# EasyEDA Pro project 25工创PCB.eprj, schematic 云台底部分线板原理图
Board Name: 分线板; Create Date: 2024-12-19; Page Name: P1; Project Name: 25工创PCB; Schematic Name: Schematic2; Update Date: 2024-12-21; Company: 嘉立创EDA; Page Size: A4; Version: V1.0
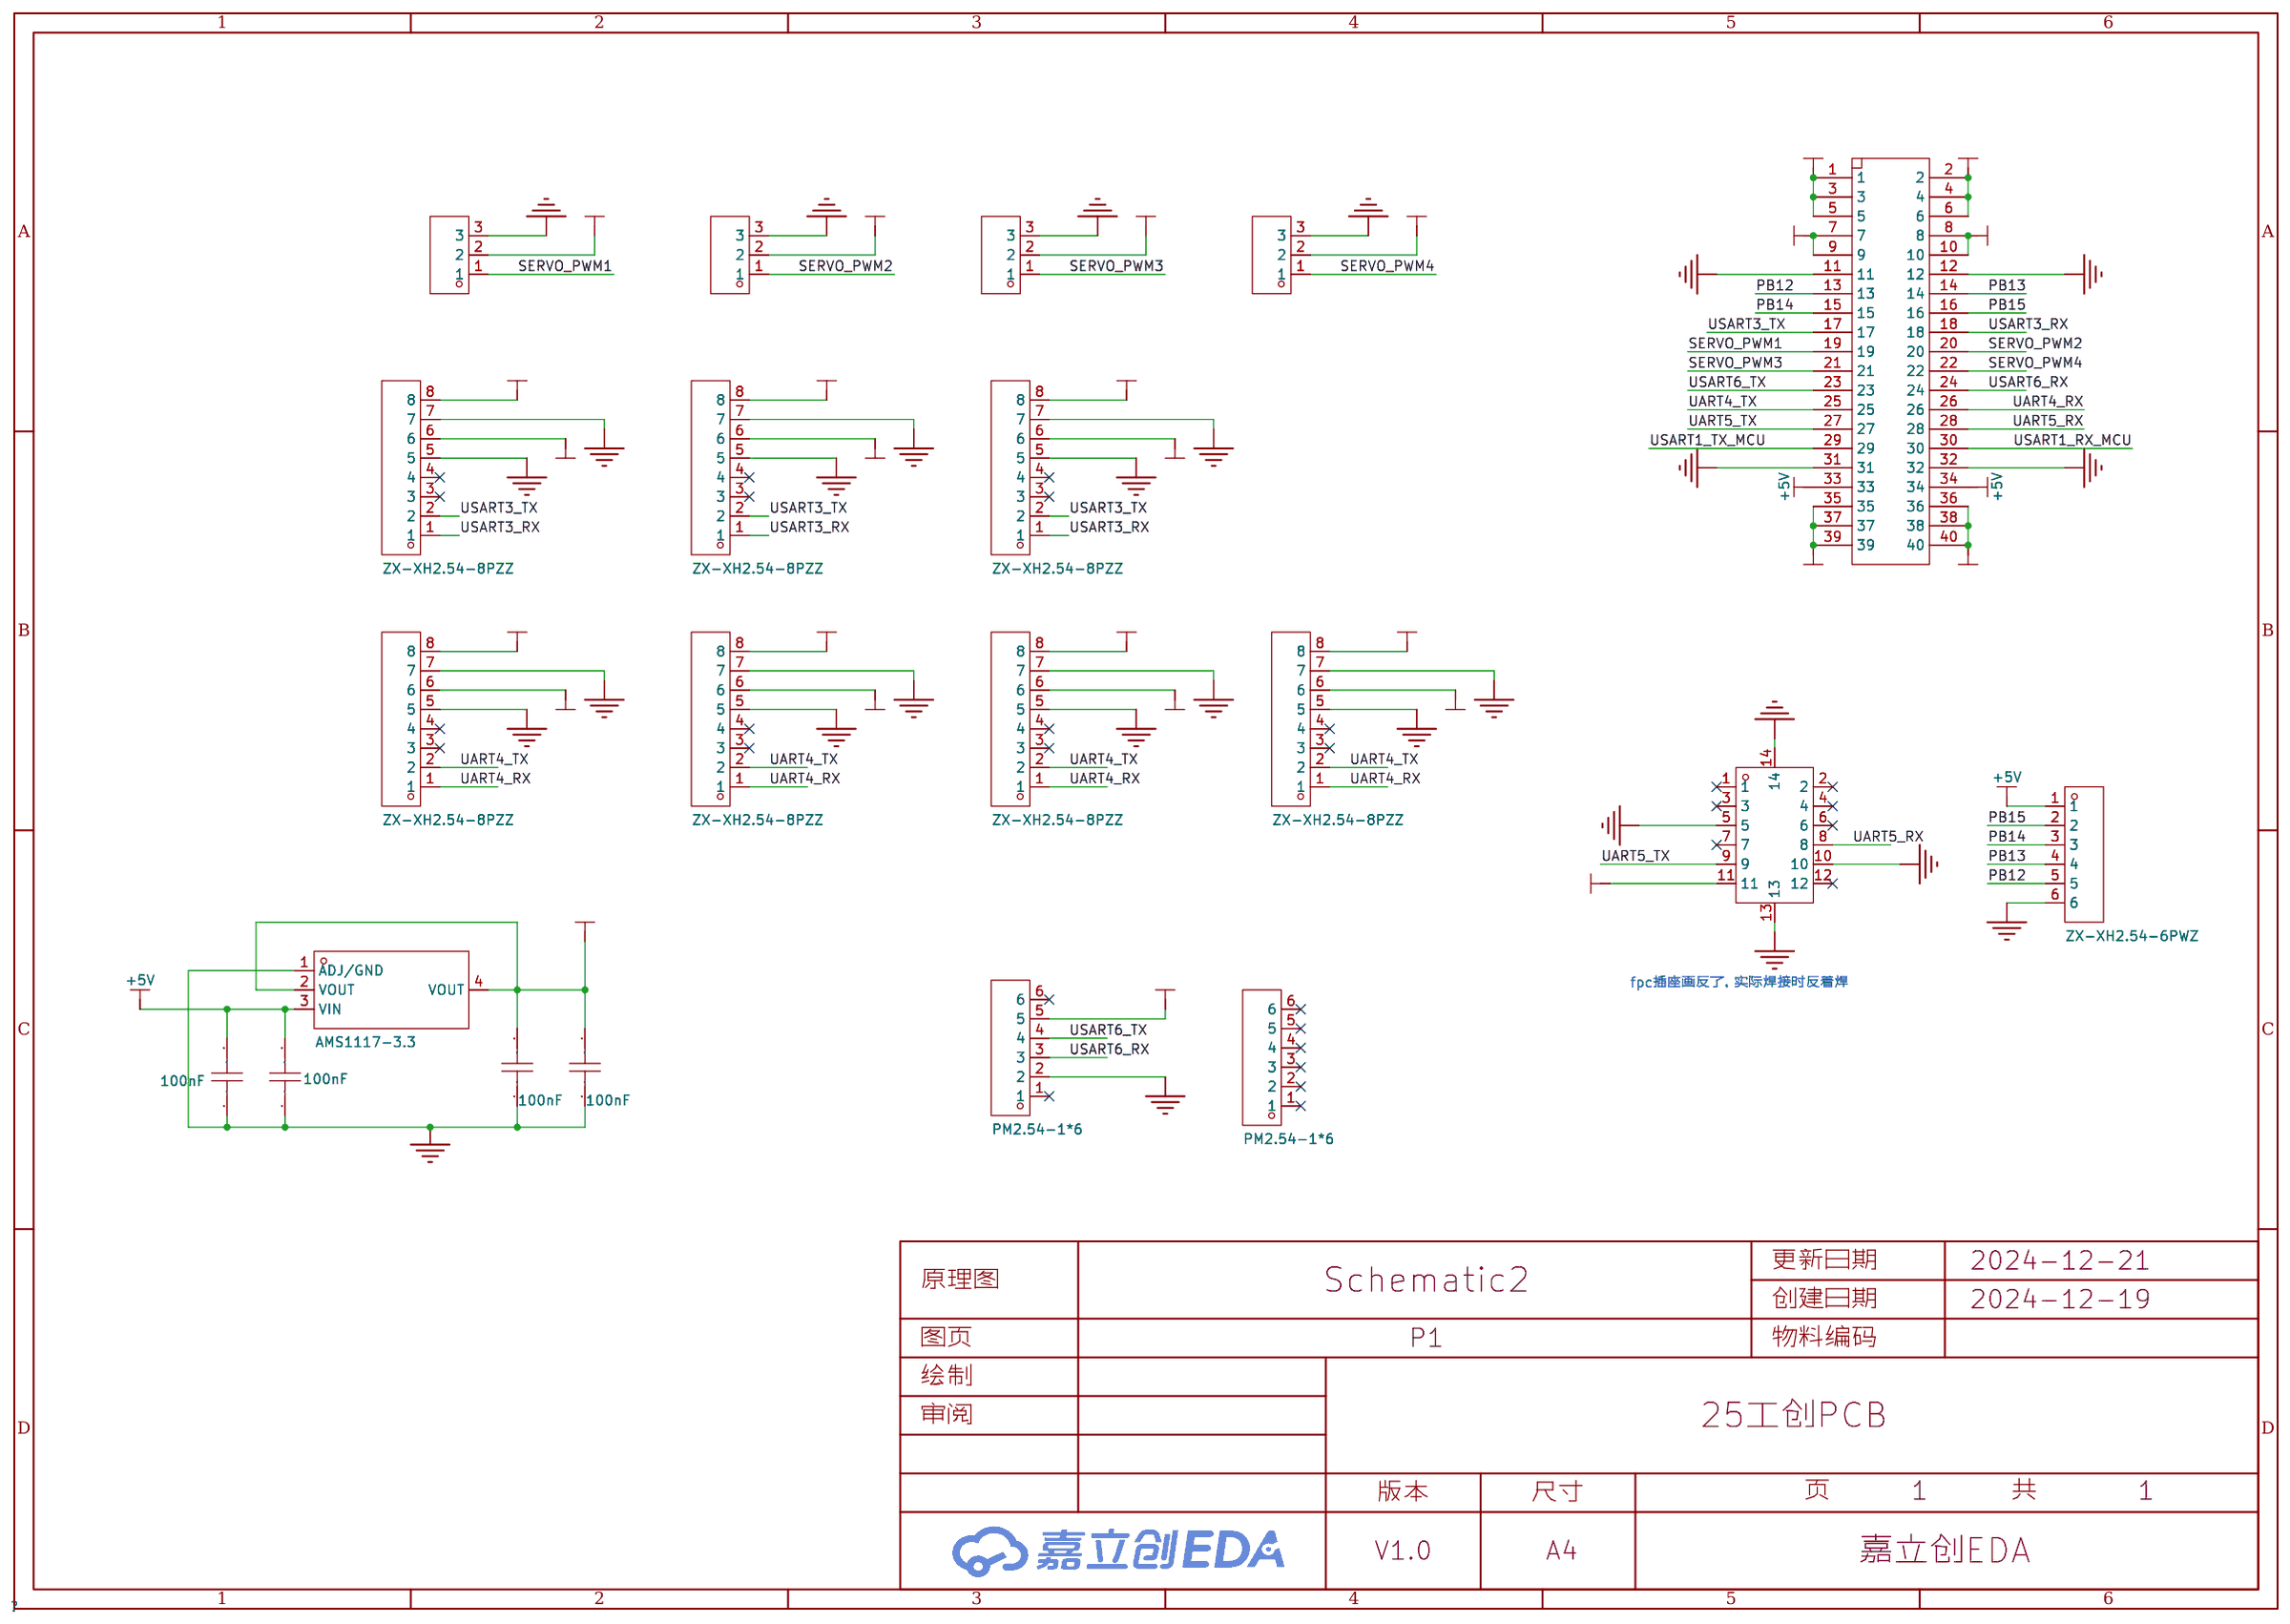
[diagram p2: schematic sheet]

## Parts
C1  100nF  [C0603]
C2  100nF  [C0603]
C3  100nF  [C0603]
C4  100nF  [C0603]
CN1  B-3000R40P-0110  [IDC-TH_40P-P2.54_300R-40P]
CN2  ZX-XH2.54-8PZZ  [CONN-TH_8P-P2.50-XH2.54-8P]
CN3  ZX-XH2.54-8PZZ  [CONN-TH_8P-P2.50-XH2.54-8P]
CN4  ZX-XH2.54-8PZZ  [CONN-TH_8P-P2.50-XH2.54-8P]
CN5  ZX-XH2.54-8PZZ  [CONN-TH_8P-P2.50-XH2.54-8P]
CN6  ZX-XH2.54-8PZZ  [CONN-TH_8P-P2.50-XH2.54-8P]
CN7  ZX-XH2.54-8PZZ  [CONN-TH_8P-P2.50-XH2.54-8P]
CN8  ZX-XH2.54-8PZZ  [CONN-TH_8P-P2.50-XH2.54-8P]
H1  -  [HDR-TH_3P-P2.54-V-M]
H2  -  [HDR-TH_3P-P2.54-V-M]
H3  -  [HDR-TH_3P-P2.54-V-M]
H4  -  [HDR-TH_3P-P2.54-V-M]
HWT1  PM2.54-1*6  [hdr-th_6p-p2.54-v-f]
U1  FPC-0.5AL-12PB  [FPC-SMD_12P-P0.50_XUNPU_FPC-0.5AL-12PB]
U2  ZX-XH2.54-6PWZ  [CONN-TH_6P-P2.50_ZX-XH2.54-6PWZ]
U3  AMS1117-3.3  [SOT-223_L6.5-W3.5-P2.30-LS7.0-BR]
U4  PM2.54-1*6  [hdr-th_6p-p2.54-v-f]

## Library data of the parts
C1-C4 = CAP_0603: Supplier Footprint: 0603
CN1 = B-3000R40P-0110: LCSC Part Name: 2.54mm 2x20P 排数:2 每排P数:20; Supplier Part: C146628; Manufacturer: Ckmtw(灿科盟); Supplier Footprint: 弯插,P=2.54mm; JLCPCB Part Class: 扩展库; Datasheet: https://atta.szlcsc.com/upload/public/pdf/source/20180105/C132444_15151572301921234454.pdf; Supplier: LCSC; Connector Type: 简牛座; Pitch: 2.54mm; Structure: 2x20P; Holder Type: 弯插; Row Spacing: 2.54mm; Number of Rows: 2; Pin Number in each Row: 20; Contact Material: 黄铜; Contact Plating: 金
CN2-CN8 = ZX-XH2.54-8PZZ: Supplier Part: C7429638; Manufacturer: Megastar(兆星); Supplier Footprint: 插件,P=2.54mm; JLCPCB Part Class: 扩展库; Datasheet: https://atta.szlcsc.com/upload/public/pdf/source/20230619/688603DEA58996C00B1F33C46797D2C3.pdf; Supplier: LCSC; Pins Structure: 1x8P; Pitch: 2.54mm; Mounting Style: 直插; Reference Series: XH; Number of Pins: 8P; Number of Rows: 1; Number of PINs Per Row: 8; Current Rating (Max): 3A; Contact Material: 黄铜; Contact Plating: 锡; Operating Temperature Range: -25℃~+85℃
H1-H4 = HDR-M_2.54_1x3P: Supplier Part: C2937625; Supplier Footprint: 插件
HWT1 U4 = PM2.54-1*6: 插孔结构:1x6P;间距:2.54mm;行距:2.54mm;圆孔/方孔:方孔;安装类型:直插;排数:单排;总孔位数:6P;额定电流:2.5A;插孔方向:顶部;塑高:8.5mm;工作温度范围:-40℃~+105℃;; LCSC Part Name: 间距:2.54mm 1x6P 直插; Supplier Part: C5224026; Manufacturer: ZHOURI(洲日); Supplier Footprint: 插件,P=2.54mm; JLCPCB Part Class: 扩展库; Datasheet: https://atta.szlcsc.com/upload/public/pdf/source/20221031/E093F9F6C4E58F4CC51055FE981DF342.pdf; Supplier: LCSC; Holes Structure: 1x6P; Pitch: 2.54mm; Row Spacing: 2.54mm; Circular Hole / Square Hole: 方孔; Mounting Type: 直插; Number of Rows: 单排; Number of Holes: 6P; Current Rating (Max): 2.5A; Holes Direction: 顶部; Insulation Height: 8.5mm; Operating Temperature Range: -40℃~+105℃
U1 = FPC-0.5AL-12PB: LCSC Part Name: 0.5mm P数:12P 立式贴片带锁; Supplier Part: C3446047; Manufacturer: XUNPU(讯普); Supplier Footprint: SMD,P=0.5mm; JLCPCB Part Class: 扩展库; Datasheet: https://atta.szlcsc.com/upload/public/pdf/source/20220630/1C272F5CC0929E3CB4691D269C5BE743.pdf; Supplier: LCSC
U2 = ZX-XH2.54-6PWZ: Supplier Part: C7429645; Manufacturer: Megastar(兆星); Supplier Footprint: 弯插,P=2.54mm; JLCPCB Part Class: 扩展库; Datasheet: https://atta.szlcsc.com/upload/public/pdf/source/20230619/9057EB94260093B1525D11E652DE2D7A.pdf; Supplier: LCSC; Pins Structure: 1x6P; Pitch: 2.54mm; Mounting Style: 弯插; Reference Series: XH; Number of Pins: 6P; Number of Rows: 1; Number of PINs Per Row: 6; Current Rating (Max): 3A; Contact Material: 黄铜; Contact Plating: 锡; Operating Temperature Range: -25℃~+85℃
U3 = AMS1117-3.3_C426566: 输出类型:固定;输出极性:正;输出通道数:1;最大输入电压:18V;输出电压:3.3V;压差:1.4V@(1A);输出电流:1A;电源纹波抑制比(PSRR):70dB@(120Hz);; LCSC Part Name: 正 Vin=18V Vout=3.3V 1A 70dB@(120Hz); Supplier Part: C426566; Manufacturer: Slkor(萨科微); Supplier Footprint: SOT-223; JLCPCB Part Class: Extended Part; Datasheet: https://atta.szlcsc.com/upload/public/pdf/source/20201231/C426566_7F22DB93439D00F3FA27143E4F28C6AA.pdf; Supplier: LCSC; Output Type: 固定; Output Polarity: 正; Number of Outputs: 1; Maximum Input Voltage: 18V; Output Voltage: 3.3V; Dropout Voltage: 1.4V@(1A); Output Current: 1A; Power Supply Rejection Ratio (PSRR): 70dB@(120Hz)

## Nets
24V_1: CN1.35 CN1.36 CN1.37 CN1.38 CN1.39 CN1.40 CN5.8 CN6.8 CN7.8 CN8.8
24V_2: CN1.1 CN1.2 CN1.3 CN1.4 CN1.5 CN1.6 CN2.8 CN3.8 CN4.8
+3V3: C3.2 C4.1 CN2.6 CN3.6 CN4.6 CN5.6 CN6.6 CN7.6 CN8.6 HWT1.5 U1.11 U3.2(VOUT) U3.4(VOUT)
+5V: C1.2 C2.2 CN1.33 CN1.34 U2.1 U3.3(VIN)
+6V: CN1.7 CN1.8 CN1.9 CN1.10 H1.2 H2.2 H3.2 H4.2
GND: C1.1 C2.1 C3.1 C4.2 CN1.11 CN1.12 CN1.31 CN1.32 CN2.5 CN2.7 CN3.5 CN3.7 CN4.5 CN4.7 CN5.5 CN5.7 CN6.5 CN6.7 CN7.5 CN7.7 CN8.5 CN8.7 H1.3 H2.3 H3.3 H4.3 HWT1.2 U1.5 U1.10 U1.13 U1.14 U2.6 U3.1(ADJ/GND)
PB12: CN1.13 U2.5
PB13: CN1.14 U2.4
PB14: CN1.15 U2.3
PB15: CN1.16 U2.2
SERVO_PWM1: CN1.19 H1.1
SERVO_PWM2: CN1.20 H2.1
SERVO_PWM3: CN1.21 H3.1
SERVO_PWM4: CN1.22 H4.1
UART4_RX: CN1.26 CN5.1 CN6.1 CN7.1 CN8.1
UART4_TX: CN1.25 CN5.2 CN6.2 CN7.2 CN8.2
UART5_RX: CN1.28 U1.8
UART5_TX: CN1.27 U1.9
USART1_RX_MCU: CN1.30
USART1_TX_MCU: CN1.29
USART3_RX: CN1.18 CN2.1 CN3.1 CN4.1
USART3_TX: CN1.17 CN2.2 CN3.2 CN4.2
USART6_RX: CN1.24 HWT1.3
USART6_TX: CN1.23 HWT1.4

Not connected (* = marked no-connect by the designer): CN2 3* 4*; CN3 3* 4*; CN4 3* 4*; CN5 3* 4*; CN6 3* 4*; CN7 3* 4*; CN8 3* 4*; HWT1 1* 6*; U1 1* 2* 3* 4* 6* 7* 12*; U4 1* 2* 3* 4* 5* 6*

## Notes on the sheet
- fpc插座画反了，实际焊接时反着焊
